# Altium schematic sheet Camera.SchDoc: Camera Chip - Group 7
size A4; DrawnBy: Lakshay Duggal, Thomas Hu; Revision: 1.0; PageSetup: Record=PageOptions|CenterHorizontal=True|CenterVertical=True|PrintScale=1.42|XCorrection=1.00|YCorrection=1.00|PrintKind=1|BorderSize=5000000|LeftOffset=0|BottomOffset=0|Orientation=2|PaperLength=1000|PaperWidth=1000|Scale=100|PaperSource=7|PrintQuality=-3|MediaType=1|DitherType=10|PrintScaleMode=1|PaperKind=A3|PaperIndex=8
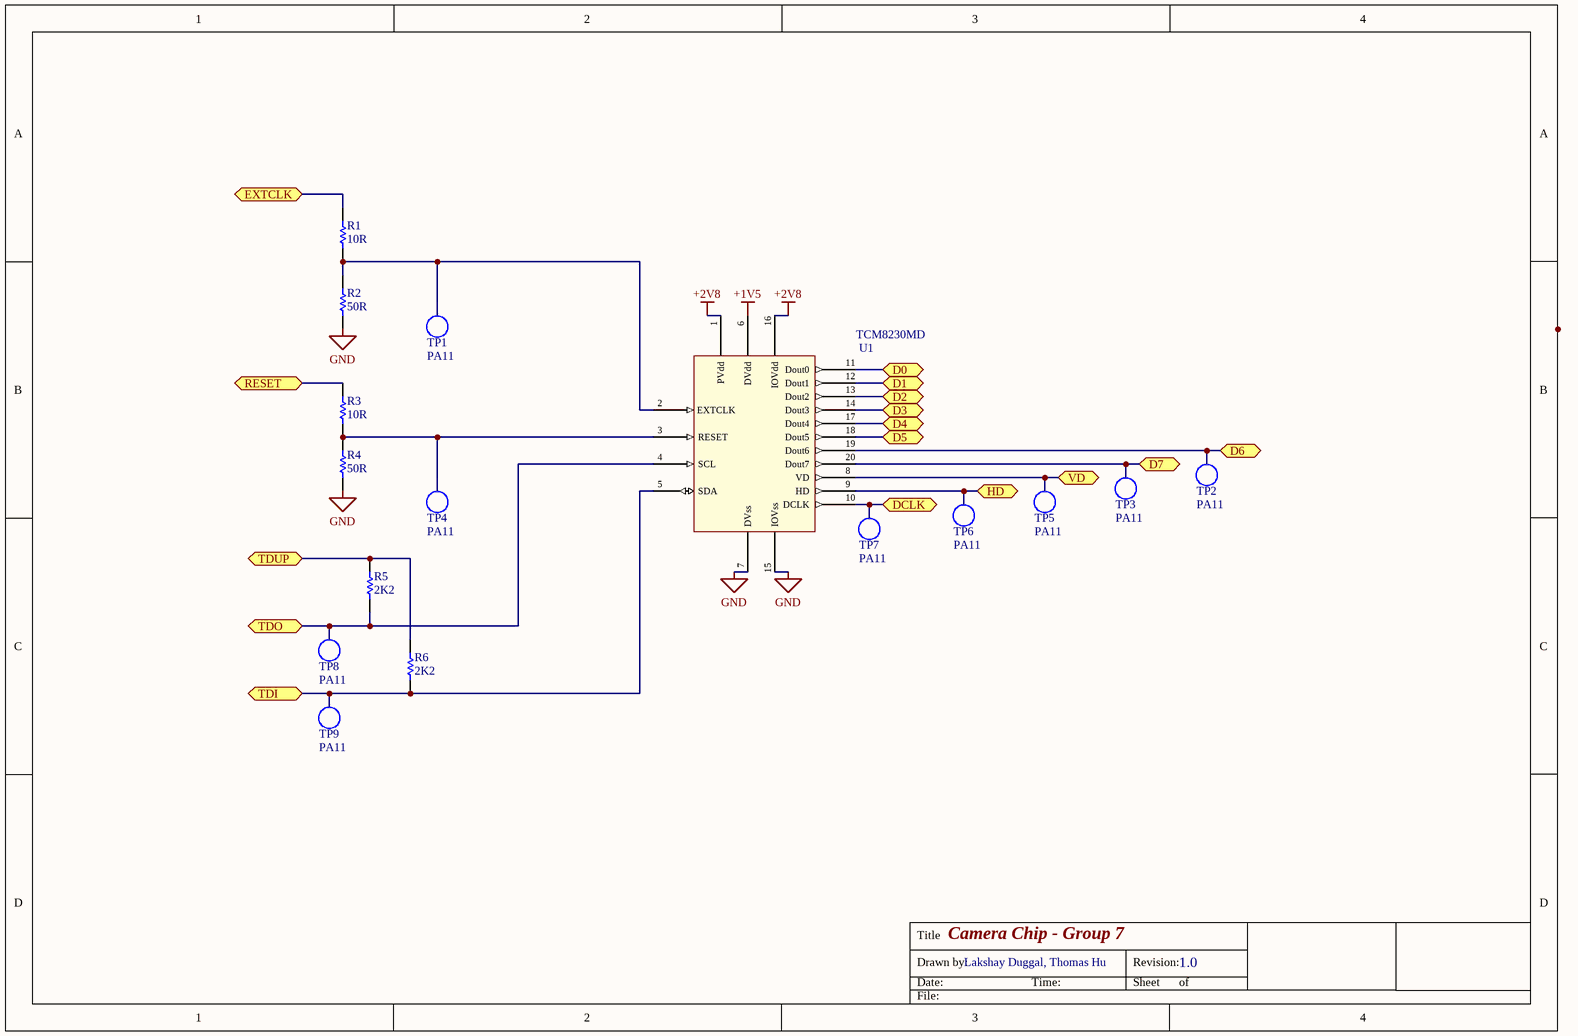
[diagram p0: Camera.SchDoc]

## Parts
R1  10R  [RESC1608L]
R2  50R  [RESC1608L]
R3  10R  [RESC1608L]
R4  50R  [RESC1608L]
R5  2K2  [RESC1608L]
R6  2K2  [RESC1608L]
TP1  PA11  [TP_0805]
TP2  PA11  [TP_0805]
TP3  PA11  [TP_0805]
TP4  PA11  [TP_0805]
TP5  PA11  [TP_0805]
TP6  PA11  [TP_0805]
TP7  PA11  [TP_0805]
TP8  PA11  [TP_0805]
TP9  PA11  [TP_0805]
U1  TCM8230MD  [TCM8230MD]

## Ports
D0, D1, D2, D3, D4, D5, D6, D7, DCLK, EXTCLK, HD, RESET, TDI, TDO, TDUP, VD

## Nets
+1V5: U1.6(DVdd)
+2V8: U1.1(PVdd) U1.16(IOVdd)
GND: R2.1 R4.1 U1.7(DVss) U1.15(IOVss)
D0: U1.11(Dout0) ; port D0
D1: U1.12(Dout1) ; port D1
D2: U1.13(Dout2) ; port D2
D3: U1.14(Dout3) ; port D3
D4: U1.17(Dout4) ; port D4
D5: U1.18(Dout5) ; port D5
D6: TP2.1(TP) U1.19(Dout6) ; port D6
D7: TP3.1(TP) U1.20(Dout7) ; port D7
DCLK: TP7.1(TP) U1.10(DCLK) ; port DCLK
EXTCLK: R1.2 ; port EXTCLK
HD: TP6.1(TP) U1.9(HD) ; port HD
RESET: R3.2 ; port RESET
TDI: R6.1 TP9.1(TP) U1.5(SDA) ; port TDI
TDO: R5.1 TP8.1(TP) U1.4(SCL) ; port TDO
TDUP: R5.2 R6.2 ; port TDUP
VD: TP5.1(TP) U1.8(VD) ; port VD
NetR1_1: R1.1 R2.2 TP1.1(TP) U1.2(EXTCLK)
NetR3_1: R3.1 R4.2 TP4.1(TP) U1.3(RESET)

## Notes on the sheet
- Title
- Drawn by:
- Date:
- Time:
- Revision:
- Sheet
- of
- File:

## Library data of the parts
R1-R6 = RS_2K2: RES 2.2K OHM 1/10W 5% 0603 SMD; Storage Location: PCB Assembly WS; Supplier: ECE Dept
  R1 R3: Value: 10R
  R2 R4: Value: 50R
  R5 R6: Value: 2K2
TP1-TP9 = TP_0805: Test Point 2.0X0.9X1.2mm SMD; Manufacturer: TE Connectivity AMP Connectors; Manufacturer Part Number: 1625854-2; Supplier 1: Digi-Key; Mounting Type: Surface Mount; Terminal: 0.079" x 0.049" x 0.057" (2.00mm x 1.25mm x 1.45mm); Type: PC Test Point; Supplier Part Number 1: A106144CT-ND
U1 = TCM8230MD: Toshiba I2C Camera; Manufacturer: Toshiba; Manufacturers PN: TCM8230MD; Supplier 1: Spark Fun; Supplier 1 PN: 8667